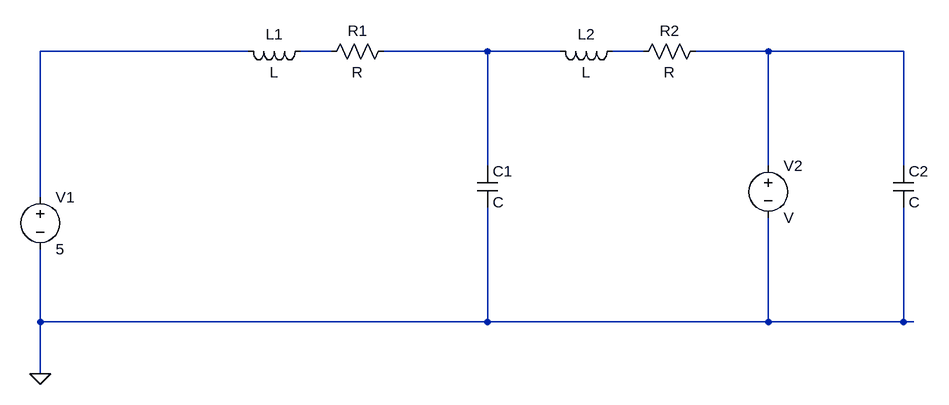
[diagram p0: schematic 2.asc]
2.asc, the LTspice schematic file:
Version 4
SHEET 1 880 680
WIRE -928 -176 -1248 -176
WIRE -800 -176 -848 -176
WIRE -560 -176 -720 -176
WIRE -448 -176 -560 -176
WIRE -320 -176 -368 -176
WIRE -128 -176 -240 -176
WIRE 80 -176 -128 -176
WIRE -560 0 -560 -176
WIRE -128 0 -128 -176
WIRE 80 0 80 -176
WIRE -1248 48 -1248 -176
WIRE -1248 240 -1248 128
WIRE -560 240 -560 64
WIRE -560 240 -1248 240
WIRE -128 240 -128 80
WIRE -128 240 -560 240
WIRE 80 240 80 64
WIRE 80 240 -128 240
WIRE 96 240 80 240
WIRE -1248 320 -1248 240
FLAG -1248 320 0
SYMBOL voltage -1248 32 R0
WINDOW 123 0 0 Left 0
WINDOW 39 0 0 Left 0
SYMATTR InstName V1
SYMATTR Value 5
SYMBOL ind -832 -192 R90
WINDOW 0 5 56 VBottom 0
WINDOW 3 32 56 VTop 0
SYMATTR InstName L1
SYMBOL res -704 -192 R90
WINDOW 0 0 56 VBottom 0
WINDOW 3 32 56 VTop 0
SYMATTR InstName R1
SYMBOL cap -576 0 R0
SYMATTR InstName C1
SYMBOL ind -352 -192 R90
WINDOW 0 5 56 VBottom 0
WINDOW 3 32 56 VTop 0
SYMATTR InstName L2
SYMBOL res -224 -192 R90
WINDOW 0 0 56 VBottom 0
WINDOW 3 32 56 VTop 0
SYMATTR InstName R2
SYMBOL voltage -128 -16 R0
SYMATTR InstName V2
SYMBOL cap 64 0 R0
SYMATTR InstName C2

The netlist it stands for:
* 2.asc
V1 N001 0 5
L1 N002 N001 L
R1 N003 N002 R
C1 N003 0 C
L2 N004 N003 L
R2 N005 N004 R
V2 N005 0 V
C2 N005 0 C
.backanno
.end